# EAGLE schematic cg2 (EAGLE 4.11)
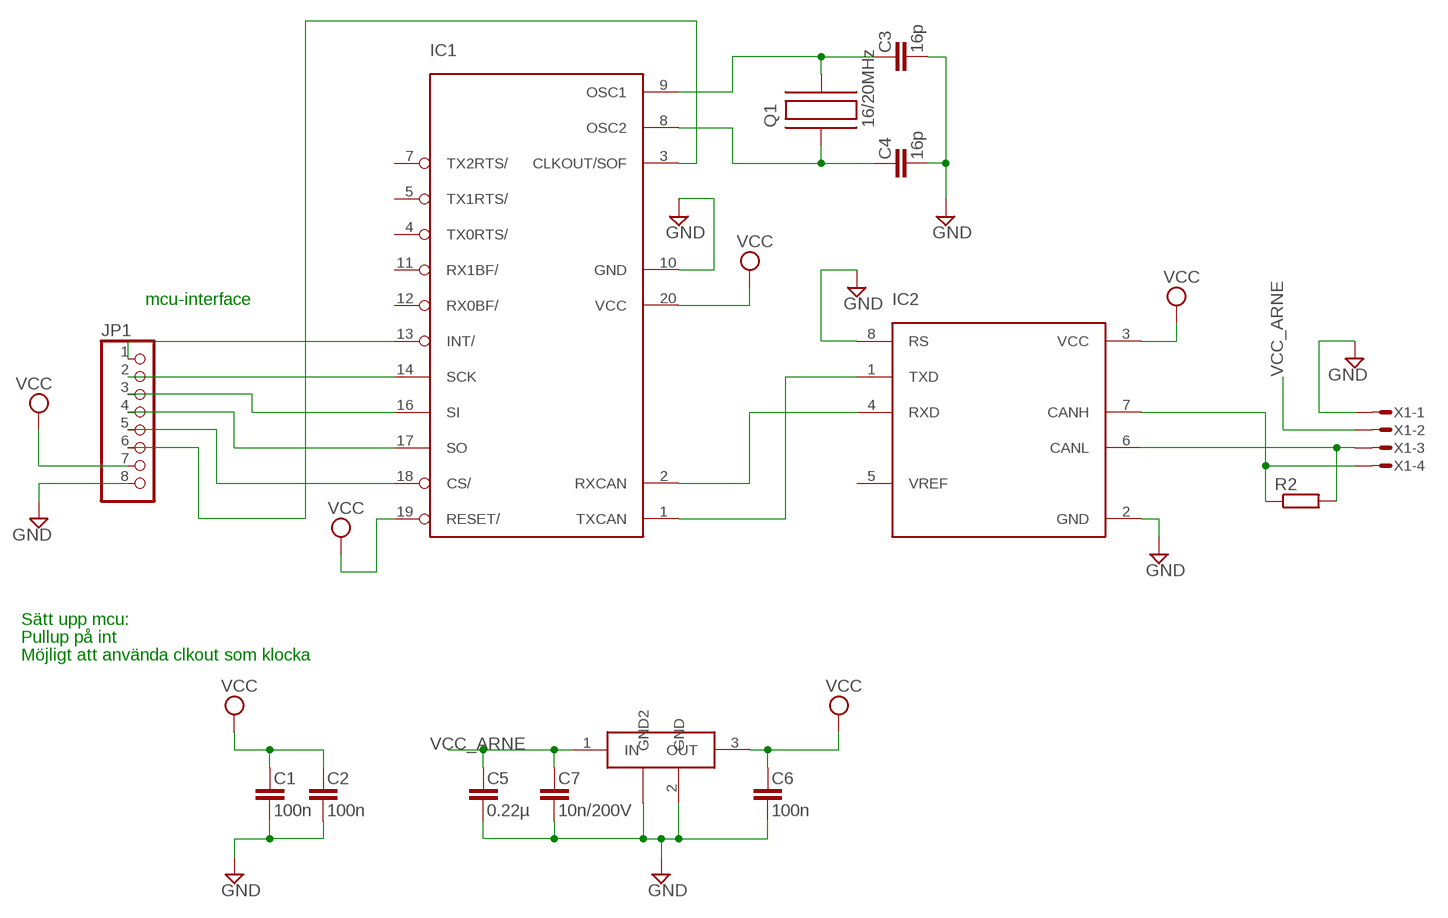
[diagram p0: schematic, sheet 1]

## Parts
C1  100n  C-EU  [C0603]
C2  100n  C-EU  [C0603]
C3  16p  C-EU  [C0603]
C4  16p  C-EU  [C0603]
C5  0.22µ  C-EU  [C0603]
C6  100n  C-EU  [C0603]
C7  10n/200V  C-EU  [C0603]
IC1  MCP2515  [TSSOP]
IC2  MCP2551  [TSSOP]
IC3  LM340MP-5.0  [SOT223]
JP1  PINHD-2X04  [2X04]
Q1  16/20MHz  C-MAC-LFA147E  [SMD]
R2  R-EUR0603  [R0603]
X1  MICROMATCH-4  [MICROMATCH-4-SMD]

## Nets
CANH: IC2.7(CANH) R2.1 X1.4
CLK: IC1.3(CLKOUT/SOF) JP1.6
CS: IC1.18(CS/) JP1.5
GND: C1.2 C2.2 C3.2 C4.2 C5.2 C6.2 C7.2 IC1.10(GND) IC2.2(GND) IC2.8(RS) IC3.2(GND) IC3.4(GND2) JP1.8 X1.1
INT: IC1.13(INT/) JP1.1
N$1: IC1.2(RXCAN) IC2.4(RXD)
N$2: IC1.1(TXCAN) IC2.1(TXD)
N$3: IC2.6(CANL) R2.2 X1.3
N$12: C3.1 IC1.9(OSC1) Q1.P$2
N$13: C4.1 IC1.8(OSC2) Q1.P$1
SCK: IC1.14(SCK) JP1.2
SI: IC1.16(SI) JP1.3
SO: IC1.17(SO) JP1.4
VCC: C1.1 C2.1 C6.1 IC1.19(RESET/) IC1.20(VCC) IC2.3(VCC) IC3.3(OUT) JP1.7
VCC_ARNE: C5.1 C7.1 IC3.1(IN) X1.2
Unconnected: IC1.4(TX0RTS/) IC1.5(TX1RTS/) IC1.7(TX2RTS/) IC1.11(RX1BF/) IC1.12(RX0BF/) IC2.5(VREF)

## Notes on the sheet
- mcu-interface
- Sätt upp mcu:
- Pullup på int
- Möjligt att använda clkout som klocka

## Library data of the parts
C1-C7 = rcl:C-EU
IC1 = mcp2515:MCP2515
IC2 = mcp2551:MCP2551
IC3 = lm340mp:LM340MP-5.0
JP1 = pinhead-mm:PINHD-2X04
Q1 = hc49-4h-smx:C-MAC-LFA147E
R2 = rcl:R-EU
X1 = micromatch-smd:MICROMATCH-4: MicroMaTch 4 7-215464-4 / 0-215464-4 Drawing Number C-215464 DDEController.pdf